# EAGLE design canmultitap (EAGLE 9.6.2)
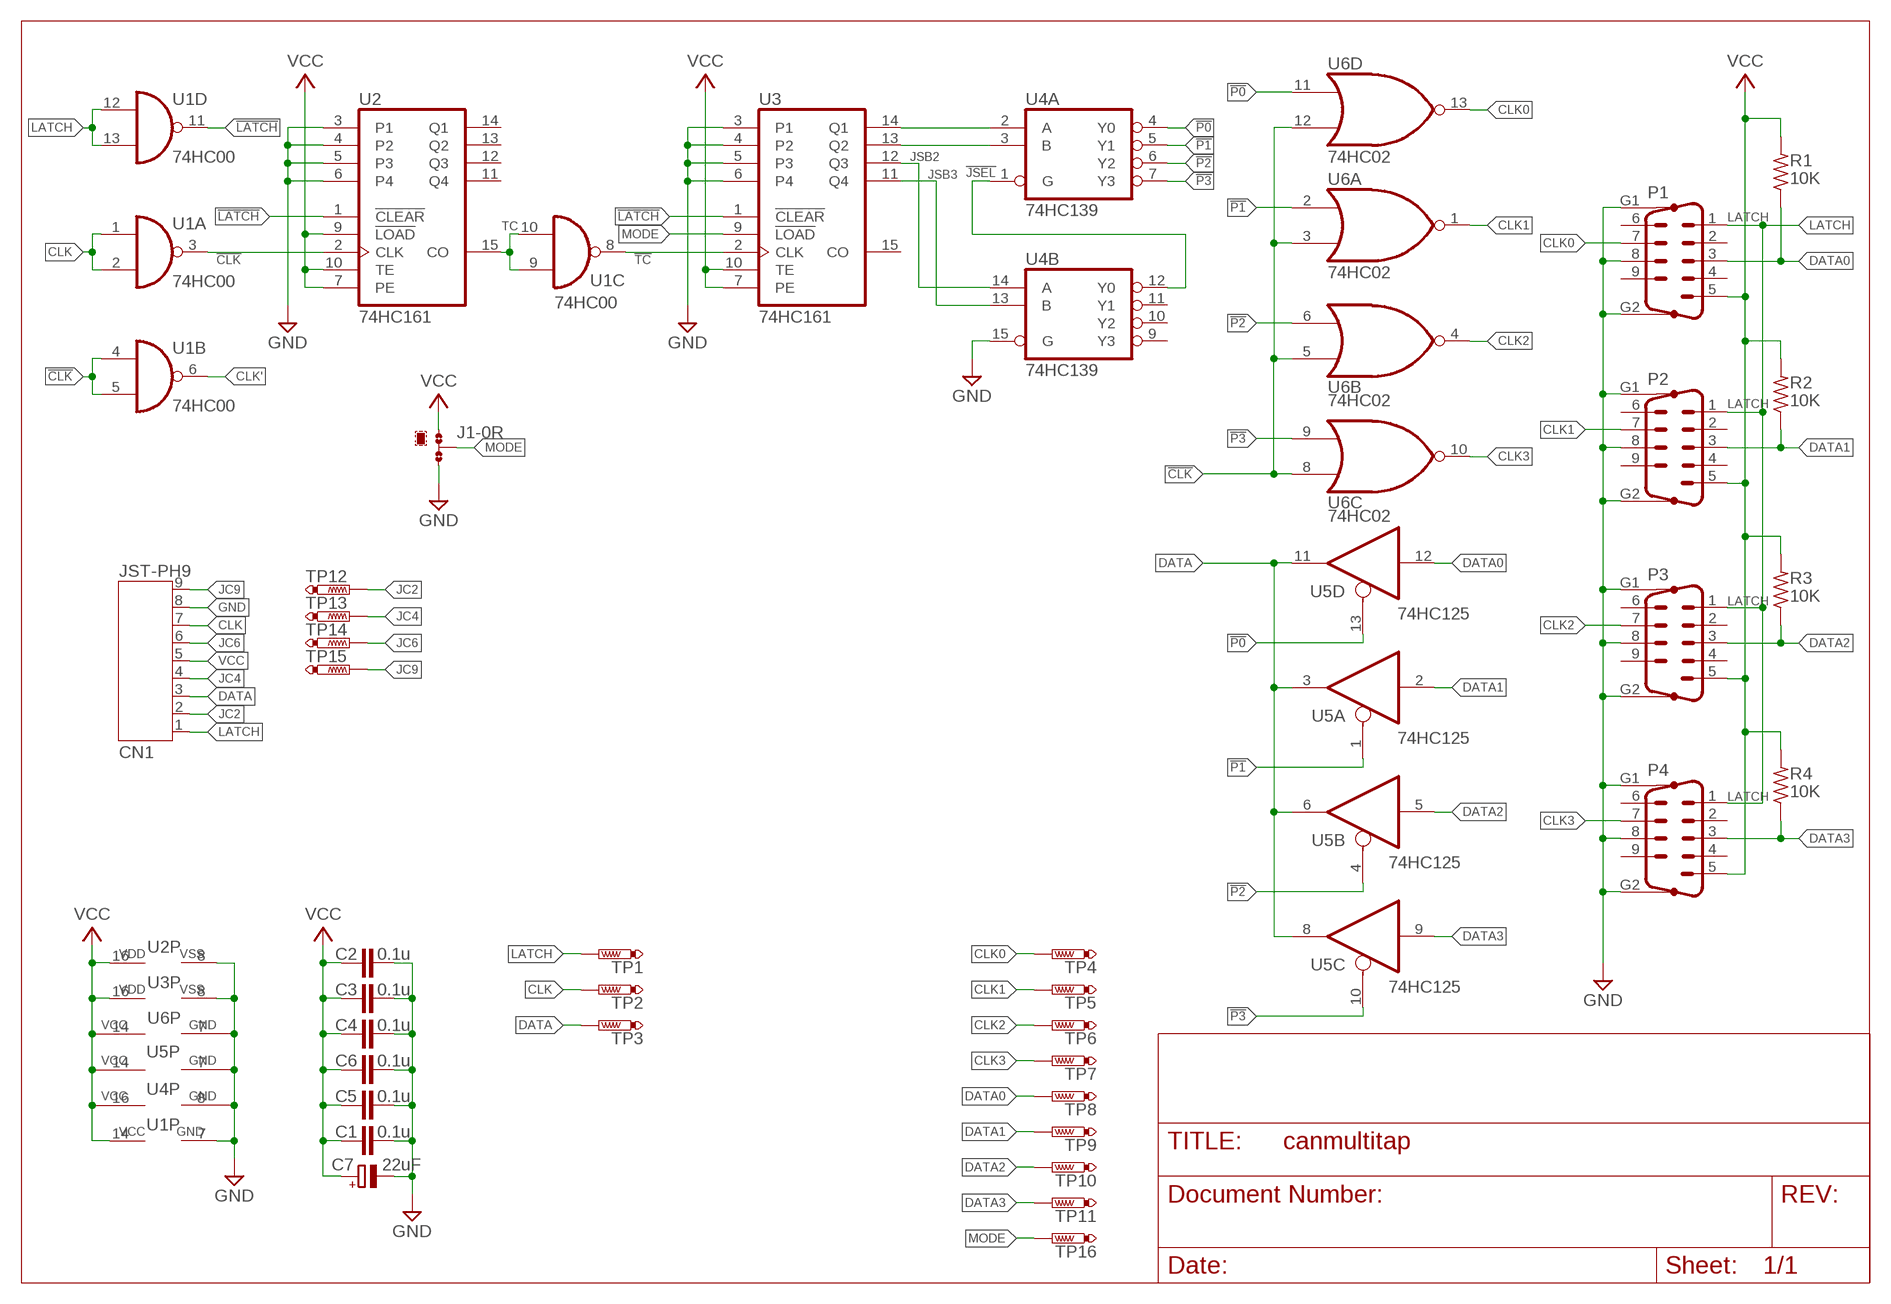
[diagram p0: schematic, sheet 1]

## Parts
C1  0.1u  C-EUC0805  [C0805]
C2  0.1u  C-EUC0805  [C0805]
C3  0.1u  C-EUC0805  [C0805]
C4  0.1u  C-EUC0805  [C0805]
C5  0.1u  C-EUC0805  [C0805]
C6  0.1u  C-EUC0805  [C0805]
C7  22uF  CPOL-EUE2-4  [E2-4]
CN1  JST-PH9  [JST-PH9]
J1  0R-JUMPA  [A0R-JMP]
P1  M09HP  [M09HP]
P2  M09HP  [M09HP]
P3  M09HP  [M09HP]
P4  M09HP  [M09HP]
R1  10K  R-US_R0805  [R0805]
R2  10K  R-US_R0805  [R0805]
R3  10K  R-US_R0805  [R0805]
R4  10K  R-US_R0805  [R0805]
TP1  PTR1TP09R  [TP09R]
TP2  PTR1TP09R  [TP09R]
TP3  PTR1TP09R  [TP09R]
TP4  PTR1TP09R  [TP09R]
TP5  PTR1TP09R  [TP09R]
TP6  PTR1TP09R  [TP09R]
TP7  PTR1TP09R  [TP09R]
TP8  PTR1TP09R  [TP09R]
TP9  PTR1TP09R  [TP09R]
TP10  PTR1TP09R  [TP09R]
TP11  PTR1TP09R  [TP09R]
TP12  PTR1TP09R  [TP09R]
TP13  PTR1TP09R  [TP09R]
TP14  PTR1TP09R  [TP09R]
TP15  PTR1TP09R  [TP09R]
TP16  PTR1TP09R  [TP09R]
U1  74HC00  7400PW  [TSSOP14]
U2  74HC161  4161PW  [TSSOP16]
U3  74HC161  4161PW  [TSSOP16]
U4  74HC139  74139PW  [TSSOP16]
U5  74HC125  74ABT125PW  [TSSOP14]
U6  74HC02  7402PW  [TSSOP14]

## Nets
!CLK: U1.3(A:O) U1.4(B:I0) U1.5(B:I1) U2.2(CLK) U6.3(A:I1) U6.5(B:I0) U6.8(C:I0) U6.12(D:I1)
!JSEL: U4.1(A:G) U4.12(B:Y0)
!LATCH: U1.11(D:O) U2.1(!CLEAR) U3.1(!CLEAR)
!P0: U4.4(A:Y0) U5.13(D:OE) U6.11(D:I0)
!P1: U4.5(A:Y1) U5.1(A:OE) U6.2(A:I0)
!P2: U4.6(A:Y2) U5.4(B:OE) U6.6(B:I1)
!P3: U4.7(A:Y3) U5.10(C:OE) U6.9(C:I1)
!TC: U1.8(C:O) U3.2(CLK)
CLK: CN1.7 TP2.TP U1.1(A:I0) U1.2(A:I1)
CLK0: P1.7 TP4.TP U6.13(D:O)
CLK1: P2.7 TP5.TP U6.1(A:O)
CLK2: P3.7 TP6.TP U6.4(B:O)
CLK3: P4.7 TP7.TP U6.10(C:O)
CLK': U1.6(B:O)
DATA: CN1.3 TP3.TP U5.3(A:O) U5.6(B:O) U5.8(C:O) U5.11(D:O)
DATA0: P1.3 R1.1 TP8.TP U5.12(D:I)
DATA1: P2.3 R2.1 TP9.TP U5.2(A:I)
DATA2: P3.3 R3.1 TP10.TP U5.5(B:I)
DATA3: P4.3 R4.1 TP11.TP U5.9(C:I)
GND: C1.2 C2.2 C3.2 C4.2 C5.2 C6.2 C7.- CN1.8 J1.3 P1.8 P1.G1 P1.G2 P2.8 P2.G1 P2.G2 P3.8 P3.G1 P3.G2 P4.8 P4.G1 P4.G2 U1.7(P:GND) U2.3(P1) U2.4(P2) U2.5(P3) U2.6(P4) U2.8(VSS) U3.3(P1) U3.4(P2) U3.5(P3) U3.6(P4) U3.8(VSS) U4.8(P:GND) U4.15(B:G) U5.7(P:GND) U6.7(P:GND)
JC2: CN1.2 TP12.TP
JC4: CN1.4 TP13.TP
JC6: CN1.6 TP14.TP
JC9: CN1.9 TP15.TP
JSB0: U3.14(Q1) U4.2(A:A)
JSB1: U3.13(Q2) U4.3(A:B)
JSB2: U3.12(Q3) U4.14(B:A)
JSB3: U3.11(Q4) U4.13(B:B)
LATCH: CN1.1 P1.1 P2.1 P3.1 P4.1 TP1.TP U1.12(D:I0) U1.13(D:I1)
MODE: J1.2 TP16.TP U3.9(!LOAD)
TC: U1.9(C:I0) U1.10(C:I1) U2.15(CO)
VCC: C1.1 C2.1 C3.1 C4.1 C5.1 C6.1 C7.+ CN1.5 J1.1 P1.5 P2.5 P3.5 P4.5 R1.2 R2.2 R3.2 R4.2 U1.14(P:VCC) U2.7(PE) U2.9(!LOAD) U2.10(TE) U2.16(VDD) U3.7(PE) U3.10(TE) U3.16(VDD) U4.16(P:VCC) U5.14(P:VCC) U6.14(P:VCC)
Unconnected: P1.2 P1.4 P1.6 P1.9 P2.2 P2.4 P2.6 P2.9 P3.2 P3.4 P3.6 P3.9 P4.2 P4.4 P4.6 P4.9 U2.11(Q4) U2.12(Q3) U2.13(Q2) U2.14(Q1) U3.15(CO) U4.9(B:Y3) U4.10(B:Y2) U4.11(B:Y1)

## Library data of the parts
C1-C6 = rcl:C-EU: CAPACITOR, European symbol; SPICEPREFIX: C
C7 = rcl:CPOL-EU: POLARIZED CAPACITOR, European symbol; SPICEPREFIX: C
CN1 = jst-ph:JST-PH9
J1 = jump-0r-smd:0R-JUMP: SMD 0R 0805 Jumper
P1-P4 = con-subd:M09HP: SUB-D; OC_FARNELL: unknown; OC_NEWARK: unknown
R1-R4 = rcl:R-US_: RESISTOR, American symbol; SPICEPREFIX: R
TP1-TP16 = testpad:PTR1: TEST PIN
U1 = 74xx-eu:74*00: Quad 2-input NAND gate
U2 U3 = 40xx:4161: Synchronous presettable 4-bit binary COUNTER
U4 = 74xx-us:74*139: Dual 2-line to 4-line DECODER/DEMULTIPLEXER
U5 = 74xx-us:74*125: Quad bus BUFFER, 3-state
U6 = 74xx-us:74*02: Quad 2-input NOR gate

## Board
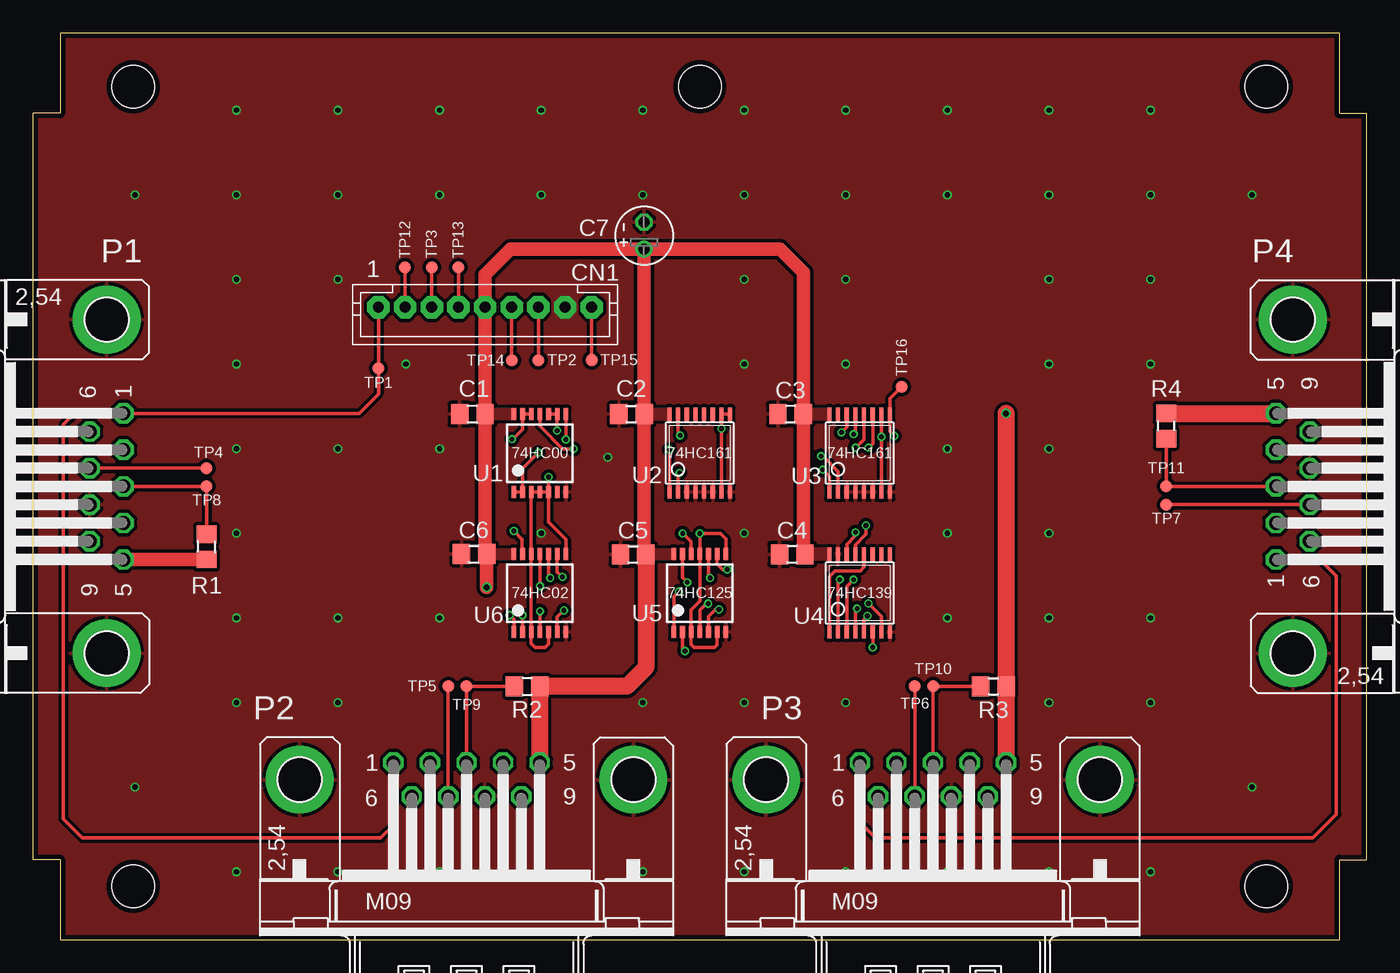
[diagram p1: board, top side]
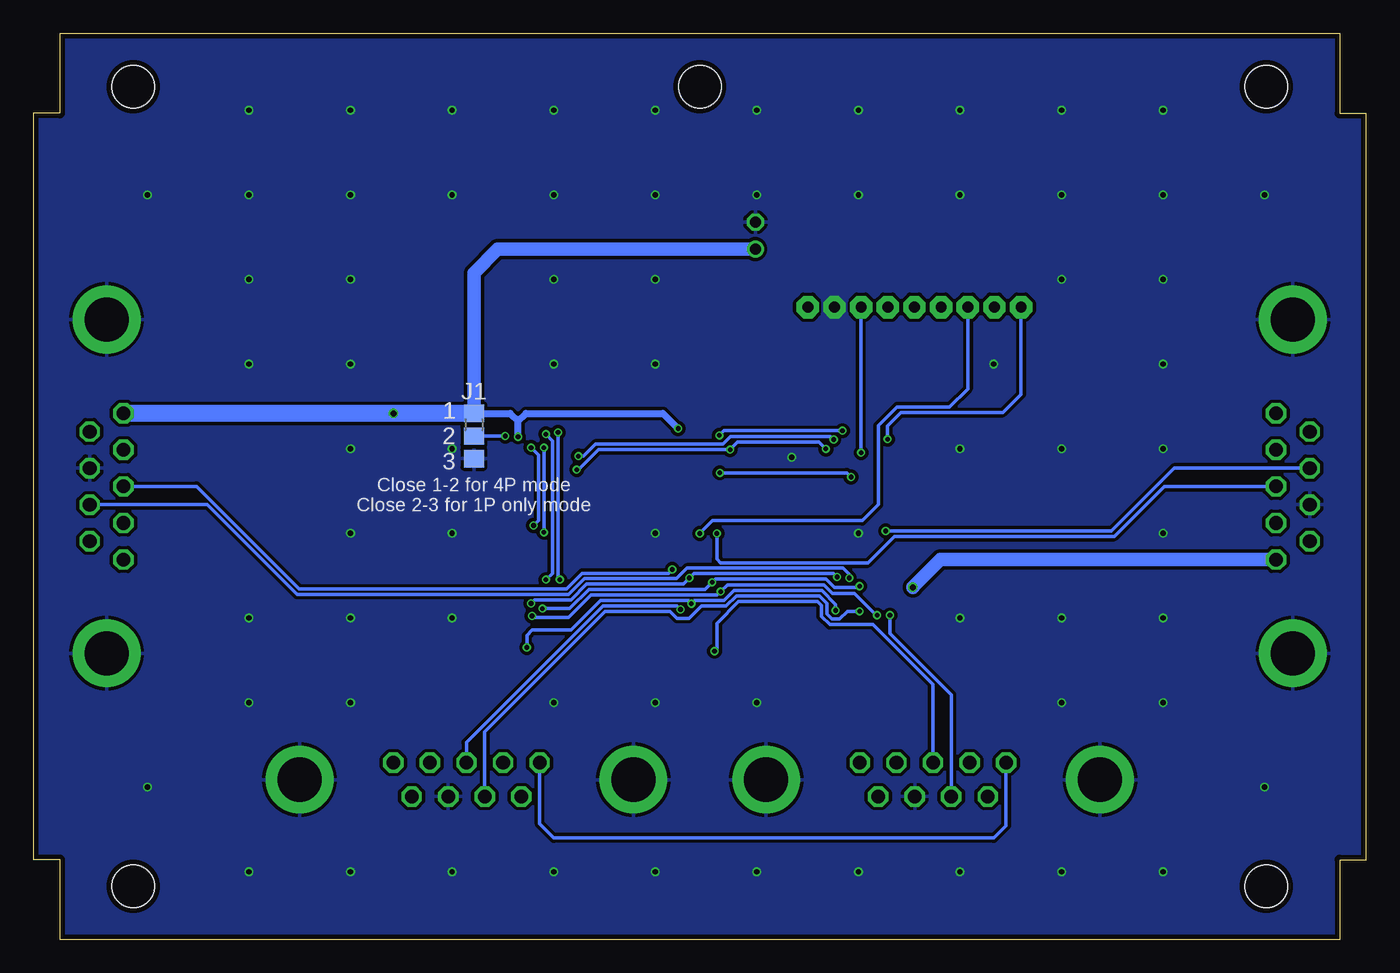
[diagram p2: board, bottom side, seen from below]

Size 100 x 68 mm. Coordinates in mm from the lower left corner, seen from the top.
Outline: 2,0 98,0 98,6 100,6 100,62 98,62 98,68 2,68 2,62 0,62 0,6 2,6 2,0
Copper layers (1*16): Top 0.035559375mm / dielectric 1.6mm / Bottom 0.035559375mm
Design rules "oshpark-2layer *": minimum track width 6mil, minimum drill 10mil, track to track 6mil, track to pad 6mil, pad to pad 6mil, via to via 6mil, smd to smd 6mil, copper to edge 15mil, drill to drill 6mil, minimum pad ring 5mil, minimum via ring 5mil, stop-mask expansion 2.5mil, vias tented up to drill 15mil, thermal gap 10mil
Holes 3.2 mm at 7.5,64 92.5,64 7.5,4 92.5,4 50,64
tRestrict: 9 lines

### Footprints (pad centres in the part's own frame; a part is rotated, then mirrored left to right if it is on the bottom)
C0805 = smd 1.3 x 1.5: 1 -0.95,0; 2 0.95,0
E2-4 = drill 0.813 pad 1.27: + -1.016,0 | drill 0.813 pad 1.27 octagon: - 1.016,0
JST-PH9 = drill 0.813 pad 1.676 octagon: 1 8,0; 2 6,0; 3 4,0; 4 2,0; 5 0,0; 6 -2,0; 7 -4,0; 8 -6,0; 9 -8,0
A0R-JMP = smd 1.5 x 1.3: 1 0,1.7; 2 0,0; 3 0,-1.7
M09HP = drill 1.016 octagon: 1 -5.486,1.27; 2 -2.743,1.27; 3 0,1.27; 4 2.743,1.27; 5 5.486,1.27; 6 -4.115,-1.27; 7 -1.372,-1.27; 8 1.372,-1.27; 9 4.115,-1.27 | drill 3.302 pad 5.08: G1 -12.522,0; G2 12.522,0
R0805 = smd 1.3 x 1.5: 1 -0.95,0; 2 0.95,0
TP09R = smd 0.9 x 0.9: TP 0,0
TSSOP14 = smd 0.35 x 0.9: 1 -1.95,-2.925; 2 -1.3,-2.925; 3 -0.65,-2.925; 4 0,-2.925; 5 0.65,-2.925; 6 1.3,-2.925; 7 1.95,-2.925; 8 1.95,2.925; 9 1.3,2.925; 10 0.65,2.925; 11 0,2.925; 12 -0.65,2.925; 13 -1.3,2.925; 14 -1.95,2.925
TSSOP16 = smd 0.305 x 0.991: 1 -2.275,-2.918; 2 -1.625,-2.918; 3 -0.975,-2.918; 4 -0.325,-2.918; 5 0.325,-2.918; 6 0.975,-2.918; 7 1.625,-2.918; 8 2.275,-2.918; 9 2.275,2.918; 10 1.625,2.918; 11 0.975,2.918; 12 0.325,2.918; 13 -0.325,2.918; 14 -0.975,2.918; 15 -1.625,2.918; 16 -2.275,2.918

### Placement (x,y rotation side)
C1  32.94,39.42 180 top
C2  44.88,39.42 180 top
C3  56.82,39.42 180 top
C4  56.94,28.91 180 top
C5  45.01,28.91 180 top
C6  33.07,28.93 180 top
C7  45.83,52.82 90 top
CN1  33.89,47.45 180 top
J1  66.94,37.79 0 bottom
P1  5.5,34 270 top
P2  32.5,12 0 top
P3  67.5,12 0 top
P4  94.5,34 90 top
R1  13,29.46 270 top
R2  37.04,19 0 top
R3  72.04,19 0 top
R4  85,38.54 90 top
TP1  25.89,42.85 0 top
TP2  37.89,43.47 0 top
TP3  29.89,50.45 0 top
TP4  13,35.37 0 top
TP5  31.13,19 0 top
TP6  66.13,19 0 top
TP7  85,32.63 0 top
TP8  13,34 0 top
TP9  32.5,19 0 top
TP10  67.5,19 0 top
TP11  85,34 0 top
TP12  27.89,50.45 0 top
TP13  31.89,50.45 0 top
TP14  35.89,43.45 0 top
TP15  41.89,43.48 0 top
TP16  65.16,41.48 0 top
U1  38,36.5 0 top
U2  50,36.5 0 top
U3  62,36.5 0 top
U4  62,26 0 top
U5  50,26 0 top
U6  38,26 0 top

### Tracks (layer width: path | path; a pad name or v marks a point on that pad's centre or on a via)
!CLK  (via drill 0.35)
  Top 0.254: U1.5 38.65,31.33 39.95,30.03 U6.8 | U6.5 38.66,22.18 38.4,21.92 37.64,21.92 37.35,22.21 U6.3 U6.12 U1.3 U1.4 U1.5 | v38.65,34.7 U1.5 | v48.5,35.02 48.38,34.9 U2.2
  Bottom 0.254: v38.65,34.7 38.97,35.02 v48.5,35.02
!JSEL
  Top 0.254: U4.1 59.73,27.25 60.14,27.66 62.05,27.66 62.33,27.94 U4.12
!LATCH  (via drill 0.35)
  Top 0.254: v40.54,36.81 39.72,36.81 38,38.54 U1.11 | v47.73,36.76 U2.1 | U3.1 59.73,34.76 v59.23,35.26
  Bottom 0.254: v40.54,36.81 41.06,37.33 47.15,37.33 v47.73,36.76 57.6,36.76 59.1,35.26 v59.23,35.26
!P0  (via drill 0.35)
  Top 0.254: U6.11 38,26.73 v38.01,26.51 | U5.13 48.7,27.17 v49.07,26.8 | U4.4 61.67,24.71 v61.8,24.84
  Bottom 0.254: v61.8,24.84 59.75,24.84 58.32,26.26 49.61,26.26 v49.07,26.8 48.82,27.05 40.52,27.05 39.89,26.42 38.1,26.42 v38.01,26.51
!P1  (via drill 0.35)
  Top 0.254: U5.1 48.05,25.73 v48.43,26.11 | U4.5 62.33,24.02 v62.59,24.28 | v36.69,24.34 36.7,24.33 U6.2
  Bottom 0.254: v62.59,24.28 62.49,24.18 59.83,24.18 58.16,25.86 48.69,25.86 v48.43,26.11 47.93,26.62 40.69,26.62 40.05,25.99 38.41,25.99 36.76,24.34 v36.69,24.34
!P2  (via drill 0.35)
  Top 0.254: v50.63,25.2 50.48,25.2 50,24.72 U5.4 | U4.6 v62.98,21.92 | v39.8,24.7 39.3,24.2 U6.6
  Bottom 0.254: v62.98,21.92 62.98,22.81 62.57,23.22 59.65,23.22 57.44,25.43 50.86,25.43 v50.63,25.2 50.41,25.43 48.19,25.43 47.42,26.19 40.85,26.19 39.8,25.15 v39.8,24.7
!P3  (via drill 0.35)
  Top 0.254: U6.9 39.3,27.6 v39.69,27.2 | U5.10 50.65,27.26 v50.78,27.13 | v62.66,25.23 63.62,24.26 U4.7
  Bottom 0.254: v39.69,27.2 39.95,27.46 50.45,27.46 v50.78,27.13 51.24,26.67 58.49,26.67 59.67,25.49 62.39,25.49 v62.66,25.23
!TC  (via drill 0.35)
  Top 0.254: U3.2 60.38,35.13 59.23,36.27 v59.1,36.27 | U1.8 v39.95,37.52
  Bottom 0.254: v59.1,36.27 58.72,36.27 57.83,37.17 48.25,37.17 47.68,37.74 40.19,37.74 39.97,37.52 v39.95,37.52
CLK  (via drill 0.35)
  Top 0.254: U1.1 U1.2 36.7,35.34 v37.89,36.53 | CN1.7 TP2.TP
  Bottom 0.254: v37.89,36.53 CN1.7
CLK0  (via drill 0.35)
  Top 0.254: v36.05,30.65 36.69,30.02 36.69,28.94 U6.13 | P1.7 TP4.TP
  Bottom 0.254: P1.7 14.41,35.37 19.13,30.65 v36.05,30.65
CLK1  (via drill 0.35)
  Top 0.254: U6.1 36.05,24.02 v35.73,24.34 | TP5.TP P2.7
  Bottom 0.254: v35.73,24.34 35.73,22.97 31.13,18.36 P2.7
CLK2  (via drill 0.35)
  Top 0.254: U6.4 v38,24.62 v38.01,24.63 | TP6.TP P3.7
  Bottom 0.254: P3.7 66.13,15.59 57.1,24.61 52.22,24.61 51.72,24.11 50.79,24.11 49.89,25.02 48.02,25.02 47.26,25.78 41.01,25.78 40.46,25.23 40.46,24.43 40.08,24.04 39.52,24.04 38.93,24.63 v38.01,24.63
CLK3  (via drill 0.35)
  Top 0.254: U6.10 38.65,27.26 v38.78,27.13 | TP7.TP P4.7
  Bottom 0.254: v38.78,27.13 38.78,27.38 39.27,27.87 50.97,27.87 51.76,27.08 58.66,27.08 59.84,25.9 80.22,25.9 86.95,32.63 P4.7
DATA  (via drill 0.35)
  Top 0.254: U5.6 51.3,22.12 51.1,21.92 49.58,21.92 49.35,22.15 U5.3 49.35,24.74 50,25.39 U5.11 v50,30.46 51.55,30.46 51.95,30.06 U5.8 | TP3.TP CN1.3
  Bottom 0.254: v50,30.46 50,30.49 49.05,31.44 37.8,31.44 36.6,32.64 36.6,38.56 35.19,39.96 31.26,39.96 29.89,41.33 CN1.3
DATA0  (via drill 0.35)
  Top 0.254: v48.72,30.46 48.75,30.46 49.35,29.86 U5.12 | P1.3 TP8.TP R1.1
  Bottom 0.254: v48.72,30.46 48.72,28.55 48.43,28.27 37.39,28.27 35.41,30.25 18.9,30.25 15.15,34 P1.3
DATA1  (via drill 0.35)
  Top 0.254: P2.3 TP9.TP R2.1 | U5.2 48.7,21.83 v48.89,21.64
  Bottom 0.254: v48.89,21.64 48.7,21.83 48.7,23.73 47.08,25.36 41.17,25.36 40.87,25.06 40.87,24.26 40.25,23.64 37,23.64 32.5,19.13 P2.3
DATA2  (via drill 0.35)
  Top 0.254: U5.5 50.65,24.25 51.16,24.77 v51.45,24.77 | R3.1 TP10.TP P3.3
  Bottom 0.254: v51.45,24.77 51.7,25.02 57.27,25.02 67.5,14.79 P3.3
DATA3  (via drill 0.35)
  Top 0.254: U5.9 51.3,28.16 51.7,27.77 v52.06,27.77 | R4.1 TP11.TP P4.3
  Bottom 0.254: v52.06,27.77 52.34,27.48 58.83,27.48 60.01,26.31 80.06,26.31 87.75,34 P4.3
GND  (via drill 0.4)
  other vias: 7.62,55.88 83.82,55.88 91.44,55.88 43.1,36.18 15.24,55.88 22.86,55.88 30.48,55.88 38.1,55.88 45.72,55.88 53.34,55.88 60.96,55.88 76.2,55.88 68.58,55.88 83.82,62.23 15.24,62.23 22.86,62.23 30.48,62.23 38.1,62.23 45.72,62.23 53.34,62.23 60.96,62.23 76.2,62.23 68.58,62.23 15.24,49.53 22.86,49.53 83.82,49.53 76.2,49.53 83.82,43.18 15.24,43.18 60.96,43.18 76.2,43.18 53.34,43.18 15.24,36.83 22.86,36.83 30.48,36.83 76.2,36.83 68.58,36.83 15.24,30.48 38.1,30.48 53.34,30.48 76.2,30.48 68.58,30.48 83.82,24.13 15.24,24.13 22.86,24.13 30.48,24.13 76.2,24.13 68.58,24.13 83.82,17.78 15.24,17.78 22.86,17.78 45.72,17.78 53.34,17.78 60.96,17.78 76.2,17.78 7.62,11.43 91.44,11.43 83.82,5.08 15.24,5.08 22.86,5.08 30.48,5.08 38.1,5.08 45.72,5.08 53.34,5.08 60.96,5.08 76.2,5.08 68.58,5.08 27.94,43.18 60.96,49.53 53.34,49.53
  pour Top (isolate 0.254, rank 6): -0.08,68.58 100.25,68.58 100.25,0 -0.08,0
  pour Bottom (isolate 0.254, rank 6): -0.08,68.58 100.25,68.58 100.25,0 -0.08,0
  pour Top (no thermals): 38.85,48.59 38.85,46.34 40.91,46.34 40.91,48.59
  pour Bottom (no thermals): 38.85,48.59 38.85,46.5 39,46.34 40.75,46.34 40.91,46.5 40.91,48.43 40.75,48.59
JC2
  Top 0.254: TP12.TP CN1.2
JC4
  Top 0.254: TP13.TP CN1.4
JC6
  Top 0.254: CN1.6 TP14.TP
JC9
  Top 0.254: CN1.9 TP15.TP
JSB0  (via drill 0.35)
  Top 0.254: U3.14 61.02,38.45 v60.63,38.05 | v60.5,27 60.38,26.88 U4.2
  Bottom 0.254: v60.5,27 60.63,27.13 v60.63,38.05
JSB1  (via drill 0.35)
  Top 0.254: U3.13 61.67,38.05 v61.55,37.92 | v61.54,27 61.02,26.49 U4.3
  Bottom 0.254: v61.55,37.92 61.03,37.41 61.03,27.49 61.52,27 v61.54,27
JSB2  (via drill 0.35)
  Top 0.254: U3.12 62.33,37.51 61.72,36.91 v61.69,36.91 | v61.69,30.56 61.69,30.3 61.02,29.64 U4.14
  Bottom 0.254: v61.69,36.91 v61.69,30.56
JSB3  (via drill 0.35)
  Top 0.254: v62.66,36.91 62.98,37.23 U3.11 | U4.13 61.67,29.61 62.48,30.41 v62.48,31.07
  Bottom 0.254: v62.66,36.91 62.1,36.35 62.1,31.45 v62.48,31.07
LATCH  (via drill 0.35)
  Top 0.254: U1.12 U1.13 36.7,38.25 35.99,37.54 v35.91,37.54 | CN1.1 TP1.TP 25.89,40.94 24.44,39.49 P1.1 3.1,39.49 2.25,38.64 2.25,9.05 3.68,7.62 26.07,7.62 27.01,8.57 P2.1 | P3.1 62.01,8.79 63.18,7.62 95.98,7.62 97.76,9.4 97.76,27.27 96.52,28.51 P4.1
  Bottom 0.254: v35.91,37.54 35.91,38.53 34.89,39.54 27.26,39.54 25.89,40.91 CN1.1 | P2.1 27.01,8.55 27.94,7.62 60.96,7.62 62.01,8.67 P3.1
MODE  (via drill 0.35)
  Top 0.254: TP16.TP 64.28,40.59 U3.9 64.28,38.1 v64.59,37.79
  Bottom 0.254: v64.59,37.79 J1.2
TC  (via drill 0.35)
  Top 0.254: U1.10 U1.9 v39.29,38.18 | U2.15 48.38,37.99 v48.53,37.83
  Bottom 0.254: v48.53,37.83 48.18,38.18 v39.29,38.18
VCC  (via drill 0.35, 0.45)
  Top 0.254: U3.10 v63.62,37.73 v63.63,37.73 63.63,33.59 U3.7 | U2.9 U2.10 v51.62,38.34 U2.7
  Top 1.016: C5.1 45.83,29.04 C2.1 C7.+ | C4.1 57.77,29.04 C3.1 57.77,50.06 56.02,51.8 C7.+ | v34.02,26.43 C6.1 33.89,29.06 C1.1 CN1.5 33.89,49.89 35.8,51.8 C7.+ | P1.5 R1.2
  Top 1.27: P2.5 R2.2 44.53,19 45.95,20.43 C5.1 | P3.5 R3.2 v72.99,39.49 | R4.2 P4.5
  Bottom 0.508: J1.1 64.22,39.49 63.63,38.9 | v51.62,38.34 52.77,39.49 63.05,39.49 63.63,38.9 | v63.63,37.73 63.63,38.9
  Bottom 1.016: J1.1 66.94,50.02 65.17,51.8 C7.+ | P1.5 31.95,28.51 34.02,26.44 v34.02,26.43
  Bottom 1.27: J1.1 v72.99,39.49 P4.5
  pour Top (no thermals): 36.24,39.89 36.24,38.97 34.53,38.97 34.24,38.69 33.99,38.69 33.99,40.18 34.27,40.18 34.56,39.89
  pour Top (no thermals): 36.21,29.35 34.56,29.35 34.56,28.5 36.21,28.5
  pour Top (no thermals): 47.86,39.89 47.86,38.94 46.47,38.94 46.47,39.89
  pour Top (no thermals): 48.21,29.35 48.21,28.5 46.59,28.5 46.59,29.35
  pour Top (no thermals): 59.86,39.89 59.86,38.94 58.4,38.94 58.4,39.89
  pour Top (no thermals): 59.86,29.42 59.86,28.43 58.53,28.43 58.53,29.42

### Text on the board
tPlace: P1 | P4 | P2 | P3
bPlace: 1 / 2 / 3 | Close 1-2 for 4P mode / Close 2-3 for 1P only mode